# Altium schematic sheet DVM_TopLevel.SchDoc
size B; Organization: Mechanart, LLC; Address1: 397 Laurie Meadows Drive; Address2: Apt. 437; Address3: San Mateo, CA 94403
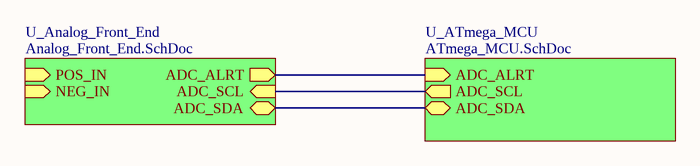
[diagram p0: DVM_TopLevel.SchDoc]

## Sub-sheets
U_Analog_Front_End = Analog_Front_End.SchDoc: POS_IN (in), NEG_IN (in), ADC_ALRT (out), ADC_SCL (in), ADC_SDA (bidir)
U_ATmega_MCU = ATmega_MCU.SchDoc: ADC_ALRT (in), ADC_SDA (bidir), ADC_SCL (out)

## Nets
(unnamed): sheet U_Analog_Front_End/ADC_ALRT, sheet U_ATmega_MCU/ADC_ALRT
(unnamed): sheet U_Analog_Front_End/ADC_SCL, sheet U_ATmega_MCU/ADC_SCL
(unnamed): sheet U_Analog_Front_End/ADC_SDA, sheet U_ATmega_MCU/ADC_SDA

## Notes on the sheet
- Title
- Size:
- Date:
- B
- Number:
- Time:
- Revision:
- Sheet
- of
- File: